# Altium project PIN_3.PrjPcb
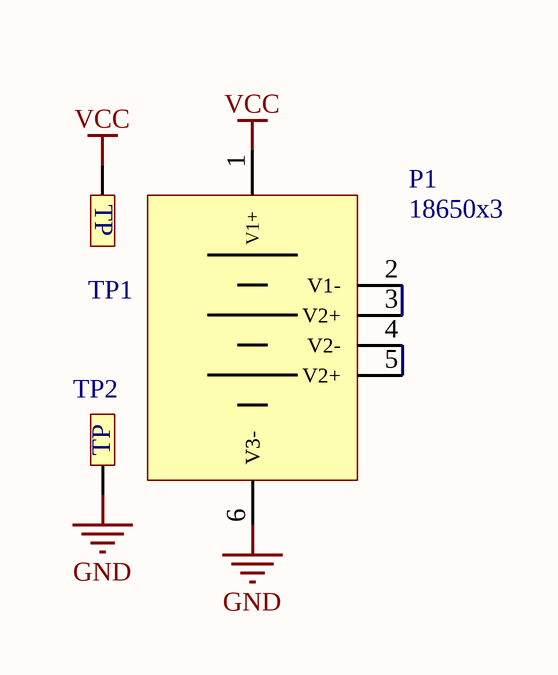
[diagram p0: PIN_3_Sch.SchDoc]
1 sheet, 3 parts. Net scope: global (net labels, ports and power ports of the same name join across sheets).
Board file: PIN_3_Pcb.PcbDoc

## Sheet PIN_3_Sch.SchDoc
size 297 x 209 mm; SheetNumber: 1; SheetTotal: 1

### Parts
P1  18650x3  [18650x3]
TP1  Test Point  [TP]  (value not drawn)
TP2  Test Point  [TP]  (value not drawn)

### Nets
GND: P1.6(V3-) TP2.TP1
VCC: P1.1(V1+) TP1.TP1
NetP1_2: P1.2(V1-) P1.3(V2+)
NetP1_4: P1.4(V2-) P1.5(V2+)

### Notes on the sheet
- NGUYEN VAN SON
- (in symbol Test Point) TP

### Library data of the parts
P1 = Power